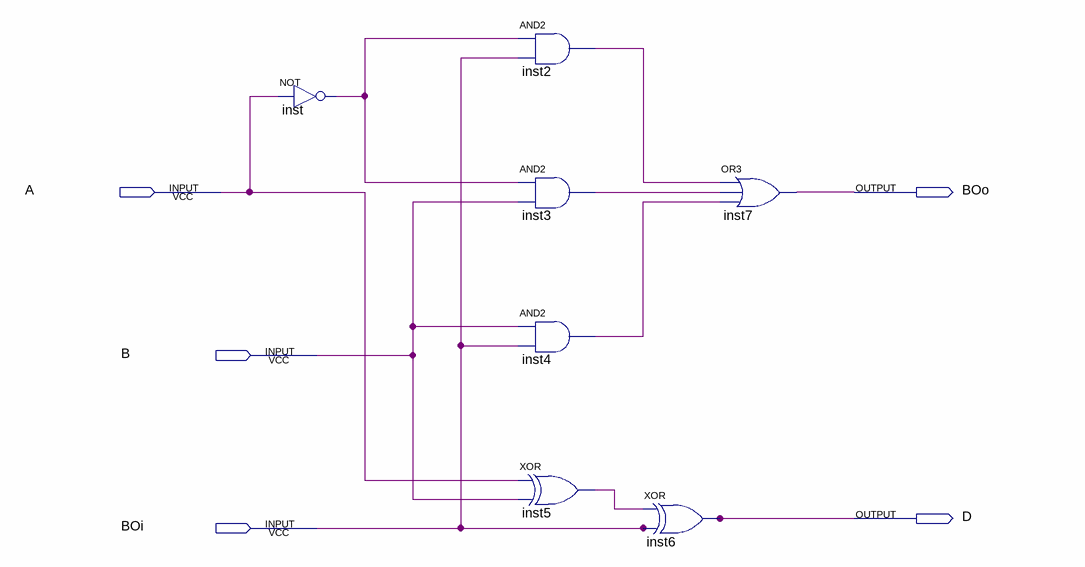
[diagram p0: schematic sheet]
// Quartus schematic FullSubtractor1.bdf as structural Verilog: 7 symbols, 5 pins
module FullSubtractor1 (
  input  A,
  input  B,
  input  BOi,
  output BOo,
  output D
);

  wire inst2_out, inst3_out, inst4_out, inst5_out, inst_out;

  not inst (inst_out, A);
  and inst2 (inst2_out, inst_out, BOi);
  and inst3 (inst3_out, inst_out, B);
  and inst4 (inst4_out, B, BOi);
  xor inst5 (inst5_out, A, B);
  xor inst6 (D, inst5_out, BOi);
  or inst7 (BOo, inst2_out, inst3_out, inst4_out);
endmodule
